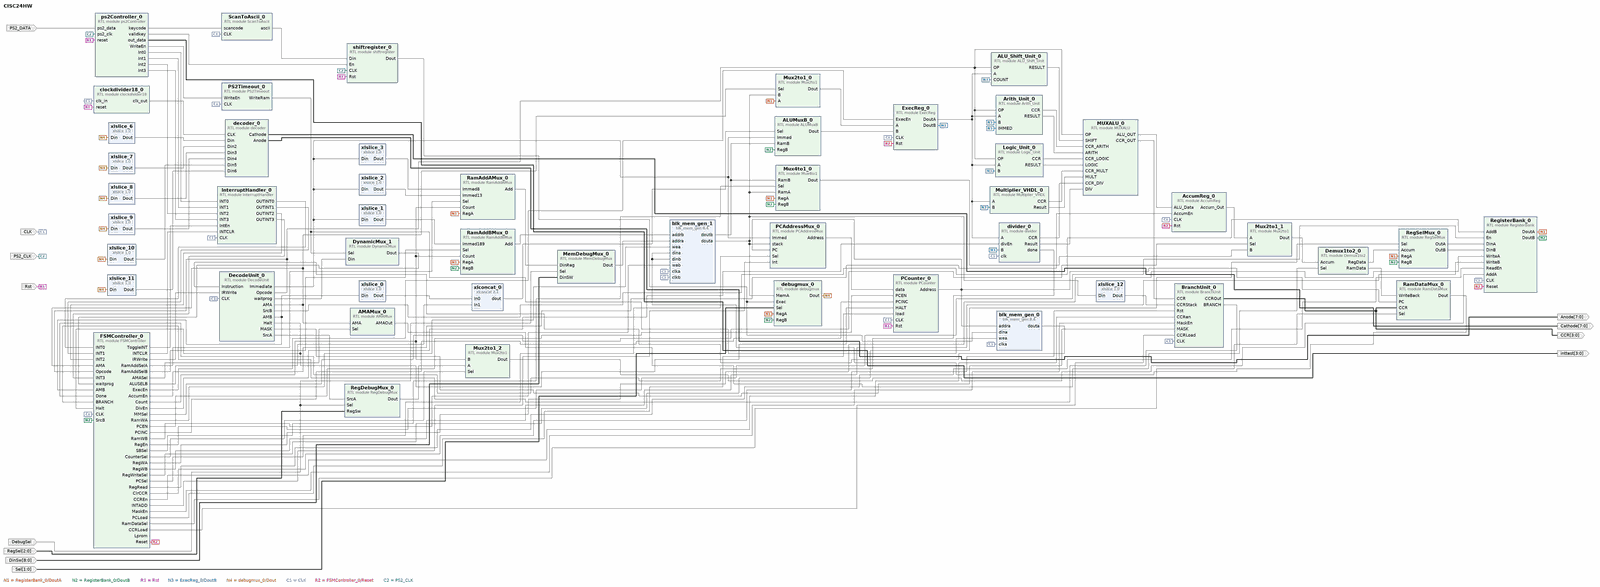
[diagram p0: block diagram of the top level, whole]
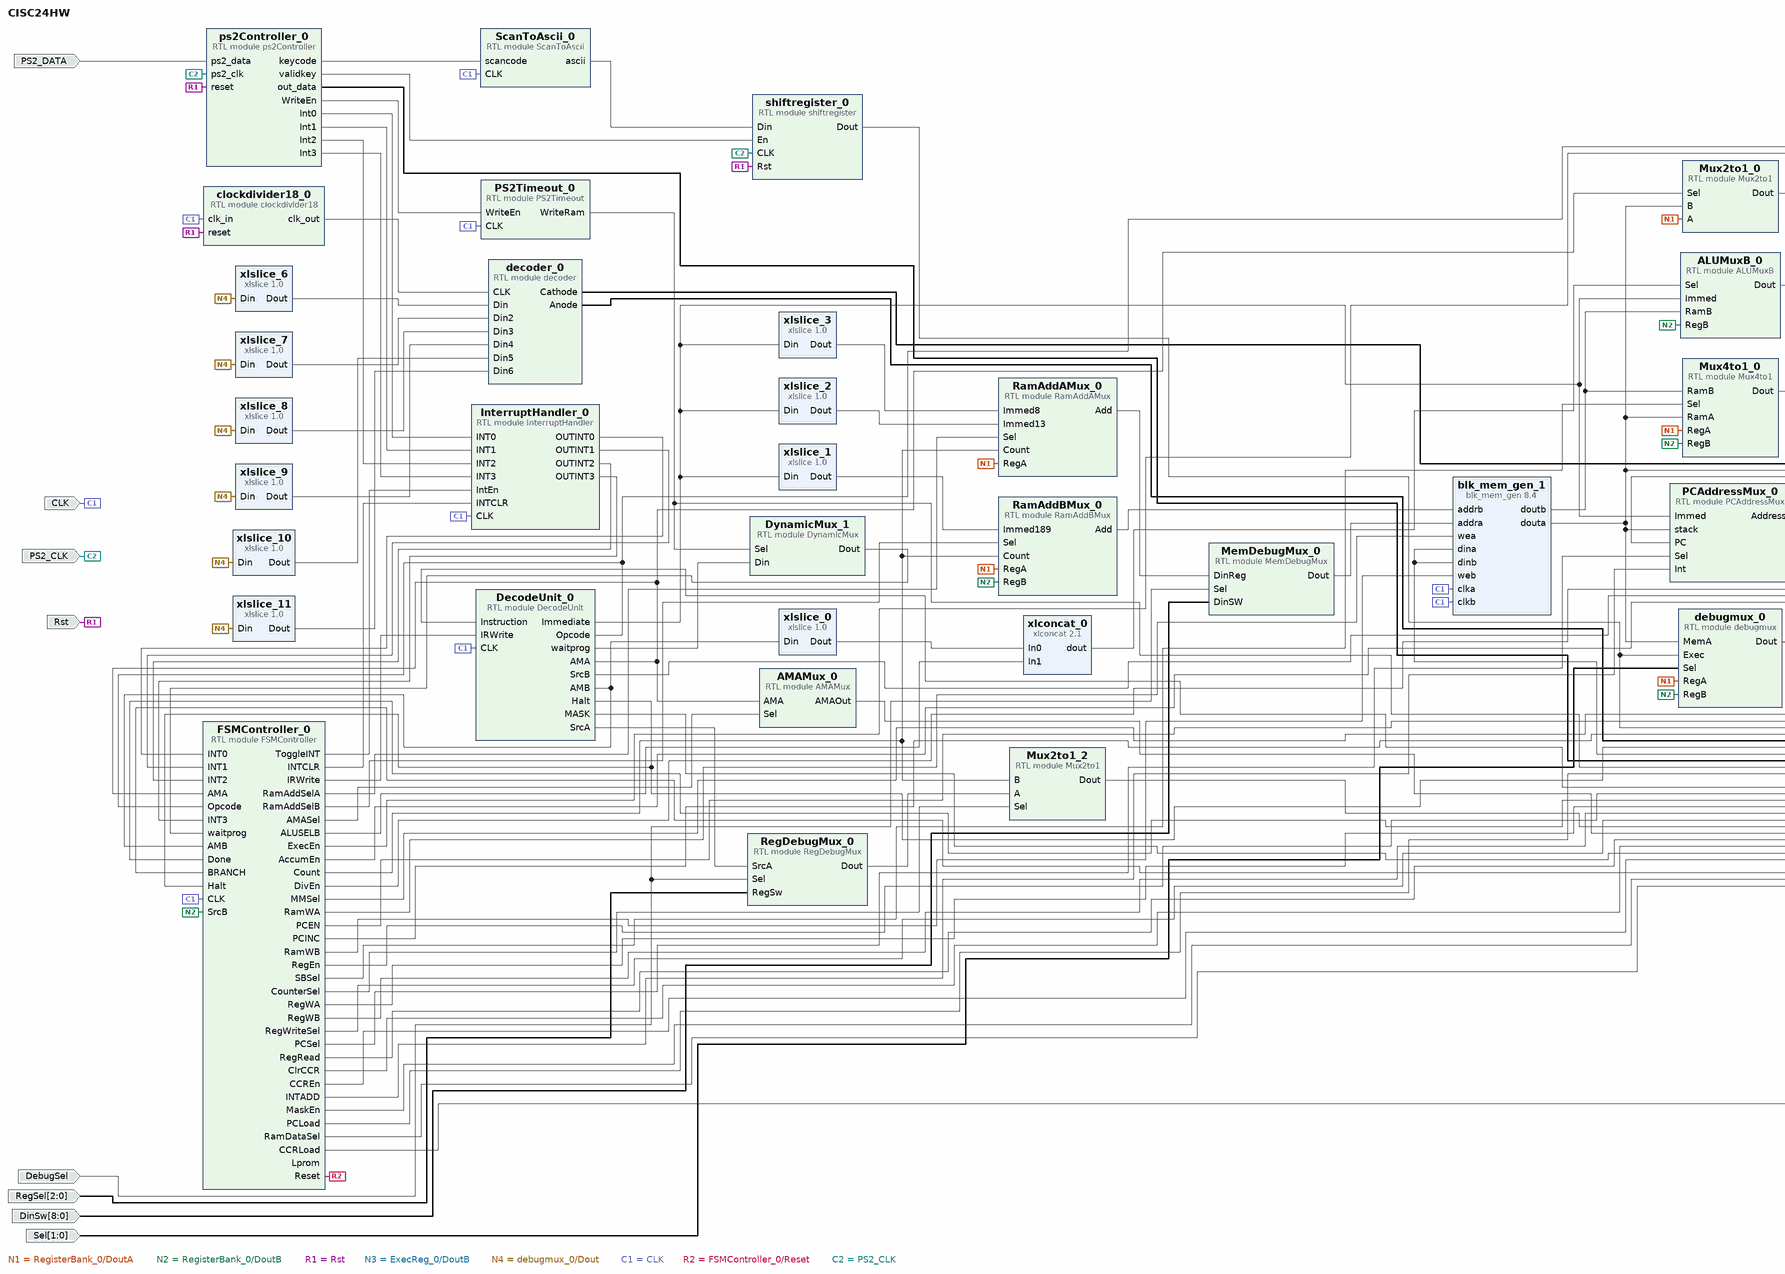
[diagram p1: block diagram of the top level, left part]
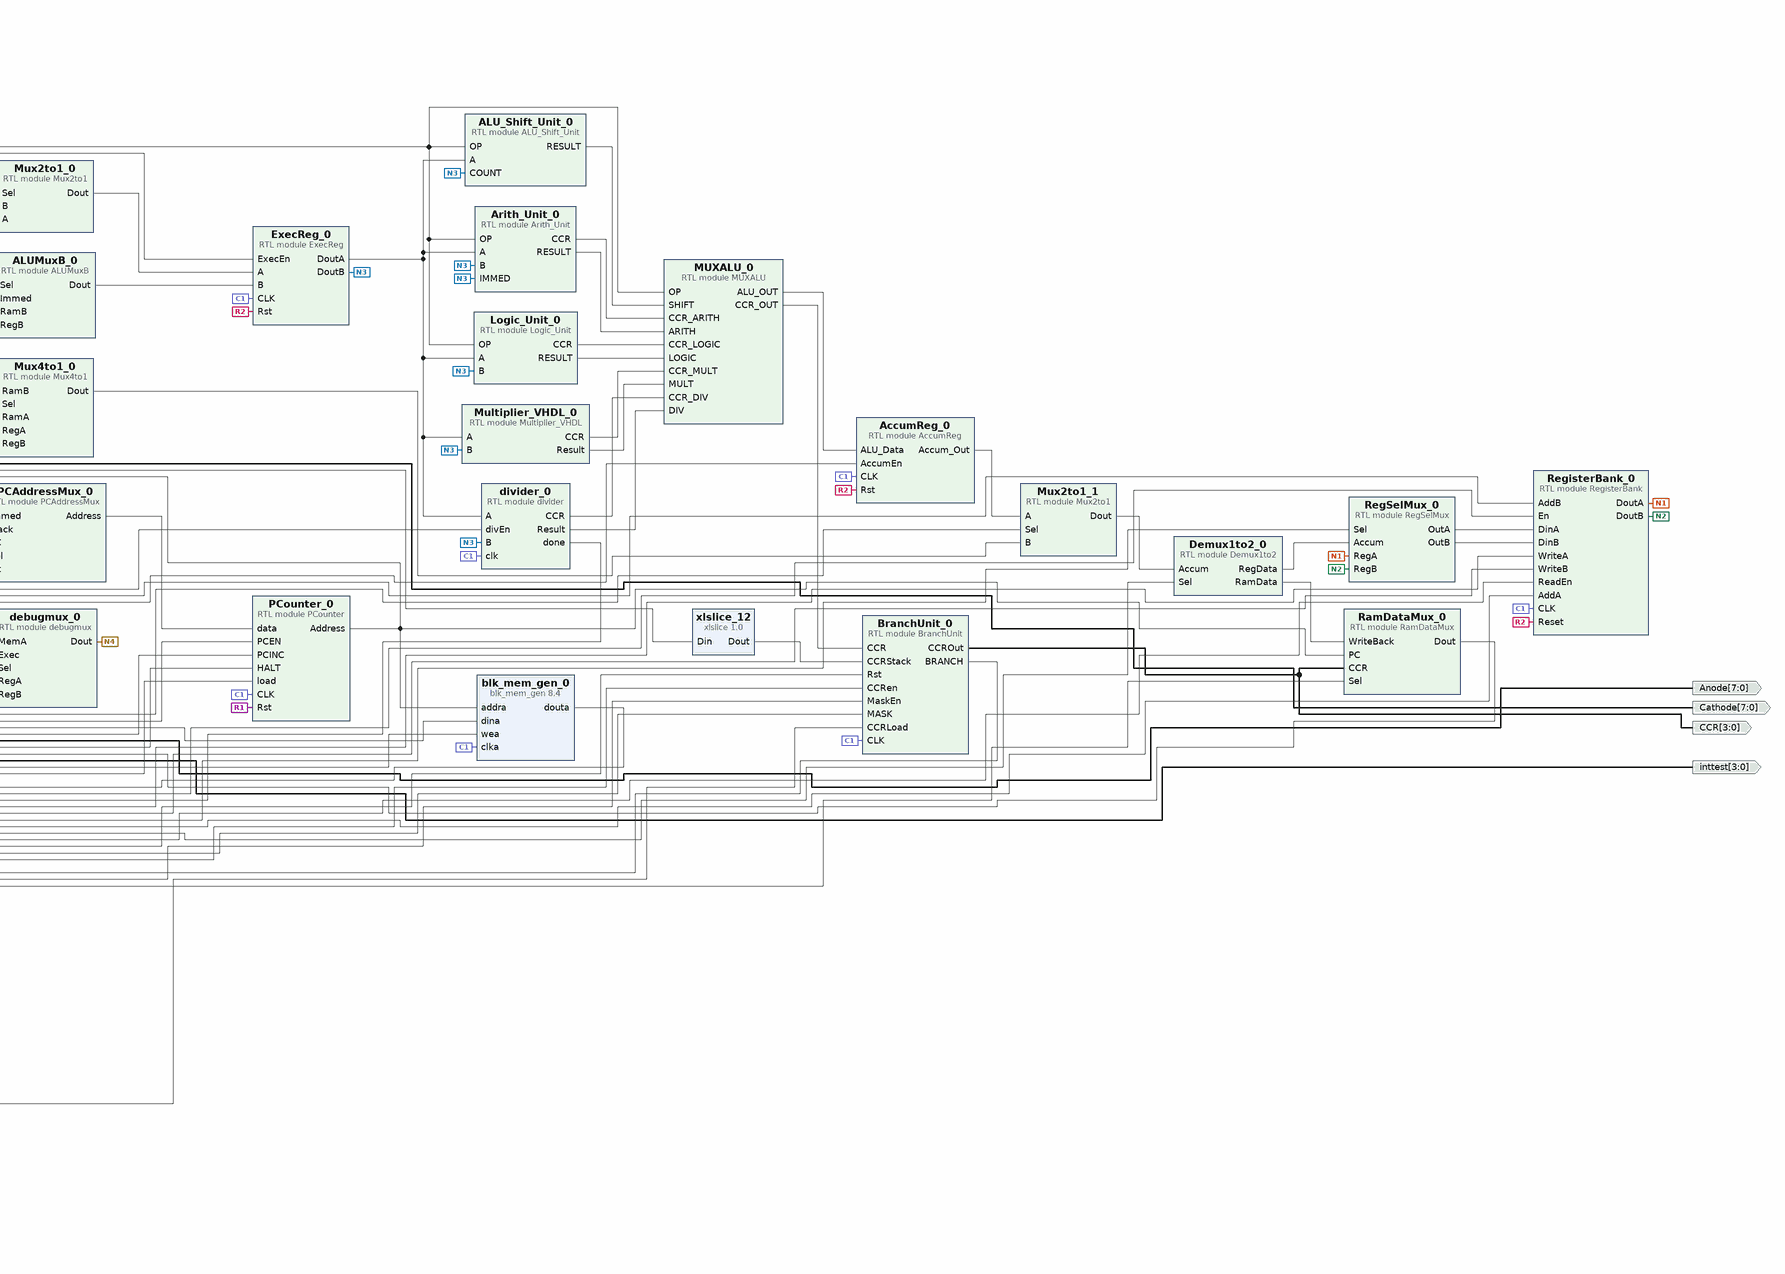
[diagram p2: block diagram of the top level, right part]
# Vivado block design CISC24HW, xc7a100tcsg324-1, Vivado 2017.4
create_bd_design CISC24HW

create_bd_port -dir I -type rst Rst
set_property -dict {CONFIG.POLARITY ACTIVE_HIGH} [get_bd_ports Rst]
create_bd_port -dir O -from 7 -to 0 -type data Cathode
create_bd_port -dir O -from 7 -to 0 -type data Anode
create_bd_port -dir I -type clk CLK
set_property -dict {CONFIG.FREQ_HZ 100000000} [get_bd_ports CLK]
create_bd_port -dir I DebugSel
create_bd_port -dir I -from 8 -to 0 -type data DinSw
create_bd_port -dir O -from 3 -to 0 -type data CCR
create_bd_port -dir I PS2_CLK
create_bd_port -dir I PS2_DATA
create_bd_port -dir O -from 3 -to 0 -type data inttest
create_bd_port -dir I -from 1 -to 0 -type data Sel
create_bd_port -dir I -from 2 -to 0 RegSel

create_bd_cell -type module -reference ALU_Shift_Unit ALU_Shift_Unit_0
create_bd_cell -type module -reference Demux1to2 Demux1to2_0
create_bd_cell -type module -reference MUXALU MUXALU_0
create_bd_cell -type module -reference Multiplier_VHDL Multiplier_VHDL_0
create_bd_cell -type module -reference Mux2to1 Mux2to1_0
create_bd_cell -type module -reference Mux2to1 Mux2to1_1
create_bd_cell -type module -reference Mux4to1 Mux4to1_0
create_bd_cell -type module -reference RegSelMux RegSelMux_0
create_bd_cell -type ip -vlnv xilinx.com:ip:blk_mem_gen:8.4 blk_mem_gen_0
set_property -dict [list \
  CONFIG.Memory_Type Single_Port_RAM \
  CONFIG.Enable_32bit_Address false \
  CONFIG.Use_Byte_Write_Enable false \
  CONFIG.Write_Width_A 24 \
  CONFIG.Write_Depth_A 512 \
  CONFIG.Read_Width_A 24 \
  CONFIG.Enable_A Always_Enabled \
  CONFIG.Register_PortA_Output_of_Memory_Primitives false \
  CONFIG.Load_Init_File true \
  CONFIG.Coe_File romint.coe \
  CONFIG.Fill_Remaining_Memory_Locations true \
  CONFIG.Remaining_Memory_Locations 080000 \
  CONFIG.Use_RSTA_Pin false \
  CONFIG.Port_A_Write_Rate 50 \
  CONFIG.use_bram_block Stand_Alone \
] [get_bd_cells blk_mem_gen_0]
create_bd_cell -type ip -vlnv xilinx.com:ip:blk_mem_gen:8.4 blk_mem_gen_1
set_property -dict [list \
  CONFIG.Memory_Type True_Dual_Port_RAM \
  CONFIG.Enable_32bit_Address false \
  CONFIG.Use_Byte_Write_Enable false \
  CONFIG.Assume_Synchronous_Clk true \
  CONFIG.Write_Width_A 24 \
  CONFIG.Write_Depth_A 522 \
  CONFIG.Read_Width_A 24 \
  CONFIG.Enable_A Always_Enabled \
  CONFIG.Write_Width_B 24 \
  CONFIG.Read_Width_B 24 \
  CONFIG.Enable_B Always_Enabled \
  CONFIG.Register_PortA_Output_of_Memory_Primitives false \
  CONFIG.Register_PortB_Output_of_Memory_Primitives false \
  CONFIG.Fill_Remaining_Memory_Locations true \
  CONFIG.Use_RSTA_Pin false \
  CONFIG.Port_B_Clock 100 \
  CONFIG.Port_B_Write_Rate 50 \
  CONFIG.Port_B_Enable_Rate 100 \
  CONFIG.use_bram_block Stand_Alone \
] [get_bd_cells blk_mem_gen_1]
create_bd_cell -type ip -vlnv xilinx.com:ip:xlconcat:2.1 xlconcat_0
create_bd_cell -type ip -vlnv xilinx.com:ip:xlslice:1.0 xlslice_0
set_property -dict {CONFIG.DIN_TO 0 CONFIG.DIN_FROM 0 CONFIG.DIN_WIDTH 2} [get_bd_cells xlslice_0]
create_bd_cell -type ip -vlnv xilinx.com:ip:xlslice:1.0 xlslice_1
set_property -dict {CONFIG.DIN_TO 9 CONFIG.DIN_FROM 18 CONFIG.DIN_WIDTH 19 CONFIG.DOUT_WIDTH 10} [get_bd_cells xlslice_1]
create_bd_cell -type ip -vlnv xilinx.com:ip:xlslice:1.0 xlslice_2
set_property -dict {CONFIG.DIN_TO 0 CONFIG.DIN_FROM 13 CONFIG.DIN_WIDTH 19 CONFIG.DOUT_WIDTH 14} [get_bd_cells xlslice_2]
create_bd_cell -type ip -vlnv xilinx.com:ip:xlslice:1.0 xlslice_3
set_property -dict {CONFIG.DIN_TO 0 CONFIG.DIN_FROM 8 CONFIG.DIN_WIDTH 19 CONFIG.DOUT_WIDTH 9} [get_bd_cells xlslice_3]
create_bd_cell -type module -reference ALUMuxB ALUMuxB_0
create_bd_cell -type ip -vlnv xilinx.com:ip:xlslice:1.0 xlslice_6
set_property -dict {CONFIG.DIN_TO 0 CONFIG.DIN_FROM 3 CONFIG.DIN_WIDTH 24 CONFIG.DOUT_WIDTH 4} [get_bd_cells xlslice_6]
create_bd_cell -type ip -vlnv xilinx.com:ip:xlslice:1.0 xlslice_7
set_property -dict {CONFIG.DIN_TO 4 CONFIG.DIN_FROM 7 CONFIG.DIN_WIDTH 24 CONFIG.DOUT_WIDTH 4} [get_bd_cells xlslice_7]
create_bd_cell -type ip -vlnv xilinx.com:ip:xlslice:1.0 xlslice_8
set_property -dict {CONFIG.DIN_TO 8 CONFIG.DIN_FROM 11 CONFIG.DIN_WIDTH 24 CONFIG.DOUT_WIDTH 4} [get_bd_cells xlslice_8]
create_bd_cell -type ip -vlnv xilinx.com:ip:xlslice:1.0 xlslice_9
set_property -dict {CONFIG.DIN_TO 12 CONFIG.DIN_FROM 15 CONFIG.DIN_WIDTH 24 CONFIG.DOUT_WIDTH 4} [get_bd_cells xlslice_9]
create_bd_cell -type ip -vlnv xilinx.com:ip:xlslice:1.0 xlslice_10
set_property -dict {CONFIG.DIN_TO 16 CONFIG.DIN_FROM 19 CONFIG.DIN_WIDTH 24 CONFIG.DOUT_WIDTH 4} [get_bd_cells xlslice_10]
create_bd_cell -type ip -vlnv xilinx.com:ip:xlslice:1.0 xlslice_11
set_property -dict {CONFIG.DIN_TO 20 CONFIG.DIN_FROM 23 CONFIG.DIN_WIDTH 24 CONFIG.DOUT_WIDTH 4} [get_bd_cells xlslice_11]
create_bd_cell -type module -reference AccumReg AccumReg_0
create_bd_cell -type module -reference ExecReg ExecReg_0
create_bd_cell -type module -reference divider divider_0
create_bd_cell -type module -reference Arith_Unit Arith_Unit_0
create_bd_cell -type module -reference Logic_Unit Logic_Unit_0
create_bd_cell -type module -reference Mux2to1 Mux2to1_2
create_bd_cell -type module -reference MemDebugMux MemDebugMux_0
create_bd_cell -type module -reference AMAMux AMAMux_0
create_bd_cell -type ip -vlnv xilinx.com:ip:xlslice:1.0 xlslice_12
set_property -dict {CONFIG.DIN_TO 0 CONFIG.DIN_FROM 3 CONFIG.DIN_WIDTH 24 CONFIG.DOUT_WIDTH 4} [get_bd_cells xlslice_12]
create_bd_cell -type module -reference InterruptHandler InterruptHandler_0
create_bd_cell -type module -reference RamAddAMux RamAddAMux_0
create_bd_cell -type module -reference RamAddBMux RamAddBMux_0
create_bd_cell -type module -reference PCAddressMux PCAddressMux_0
create_bd_cell -type module -reference RegisterBank RegisterBank_0
create_bd_cell -type module -reference RamDataMux RamDataMux_0
create_bd_cell -type module -reference shiftregister shiftregister_0
create_bd_cell -type module -reference ScanToAscii ScanToAscii_0
create_bd_cell -type module -reference decoder decoder_0
create_bd_cell -type module -reference DynamicMux DynamicMux_1
create_bd_cell -type module -reference ps2Controller ps2Controller_0
create_bd_cell -type module -reference PCounter PCounter_0
create_bd_cell -type module -reference PS2Timeout PS2Timeout_0
create_bd_cell -type module -reference DecodeUnit DecodeUnit_0
create_bd_cell -type module -reference BranchUnit BranchUnit_0
create_bd_cell -type module -reference FSMController FSMController_0
create_bd_cell -type module -reference clockdivider18 clockdivider18_0
create_bd_cell -type module -reference debugmux debugmux_0
create_bd_cell -type module -reference RegDebugMux RegDebugMux_0

# ---- connections ----

connect_bd_net [get_bd_pins ALU_Shift_Unit_0/RESULT] [get_bd_pins MUXALU_0/SHIFT]
connect_bd_net [get_bd_pins Arith_Unit_0/CCR] [get_bd_pins MUXALU_0/CCR_ARITH]
connect_bd_net [get_bd_pins Arith_Unit_0/RESULT] [get_bd_pins MUXALU_0/ARITH]
connect_bd_net [get_bd_pins DecodeUnit_0/AMA] [get_bd_pins Mux2to1_0/Sel] [get_bd_pins AMAMux_0/AMA] [get_bd_pins FSMController_0/AMA]
connect_bd_net [get_bd_pins DecodeUnit_0/Immediate] \
  [get_bd_pins xlslice_1/Din] [get_bd_pins xlslice_2/Din] [get_bd_pins xlslice_3/Din] [get_bd_pins ALUMuxB_0/Immed] \
  [get_bd_pins PCAddressMux_0/Immed]
connect_bd_net [get_bd_pins DecodeUnit_0/Opcode] \
  [get_bd_pins ALU_Shift_Unit_0/OP] [get_bd_pins MUXALU_0/OP] [get_bd_pins Arith_Unit_0/OP] [get_bd_pins Logic_Unit_0/OP] \
  [get_bd_pins FSMController_0/Opcode]
connect_bd_net [get_bd_pins DecodeUnit_0/SrcB] [get_bd_pins RegisterBank_0/AddB]
connect_bd_net [get_bd_pins FSMController_0/ALUSELB] [get_bd_pins xlconcat_0/In1]
connect_bd_net [get_bd_pins FSMController_0/AccumEn] [get_bd_pins AccumReg_0/AccumEn]
connect_bd_net [get_bd_pins FSMController_0/DivEn] [get_bd_pins divider_0/divEn]
connect_bd_net [get_bd_pins FSMController_0/ExecEn] [get_bd_pins ExecReg_0/ExecEn]
connect_bd_net [get_bd_pins FSMController_0/IRWrite] [get_bd_pins DecodeUnit_0/IRWrite]
# net FSMController_0_Lprom has one end: FSMController_0/Lprom
connect_bd_net [get_bd_pins FSMController_0/MMSel] [get_bd_pins Mux2to1_1/Sel]
connect_bd_net [get_bd_pins FSMController_0/PCEN] [get_bd_pins PCounter_0/PCEN]
connect_bd_net [get_bd_pins FSMController_0/PCINC] [get_bd_pins PCounter_0/PCINC]
connect_bd_net [get_bd_pins FSMController_0/RamAddSelA] [get_bd_pins RamAddAMux_0/Sel]
connect_bd_net [get_bd_pins FSMController_0/RamAddSelB] [get_bd_pins RamAddBMux_0/Sel]
connect_bd_net [get_bd_pins FSMController_0/RamWA] [get_bd_pins blk_mem_gen_1/wea]
connect_bd_net [get_bd_pins FSMController_0/RamWB] [get_bd_pins blk_mem_gen_1/web]
connect_bd_net [get_bd_pins FSMController_0/RegEn] [get_bd_pins RegisterBank_0/En]
connect_bd_net [get_bd_pins FSMController_0/RegWA] [get_bd_pins RegisterBank_0/WriteA]
connect_bd_net [get_bd_pins FSMController_0/RegWB] [get_bd_pins RegisterBank_0/WriteB]
connect_bd_net [get_bd_pins FSMController_0/RegWriteSel] [get_bd_pins RegSelMux_0/Sel]
connect_bd_net [get_bd_pins FSMController_0/SBSel] [get_bd_pins Mux4to1_0/Sel]
connect_bd_net [get_bd_pins Logic_Unit_0/CCR] [get_bd_pins MUXALU_0/CCR_LOGIC]
connect_bd_net [get_bd_pins Logic_Unit_0/RESULT] [get_bd_pins MUXALU_0/LOGIC]
connect_bd_net [get_bd_pins MUXALU_0/ALU_OUT] [get_bd_pins AccumReg_0/ALU_Data]
connect_bd_net [get_bd_pins Multiplier_VHDL_0/CCR] [get_bd_pins MUXALU_0/CCR_MULT]
connect_bd_net [get_bd_pins Multiplier_VHDL_0/Result] [get_bd_pins MUXALU_0/MULT]
connect_bd_net [get_bd_pins Mux2to1_0/Dout] [get_bd_pins ExecReg_0/A]
connect_bd_net [get_bd_pins Mux2to1_1/Dout] [get_bd_pins Demux1to2_0/Accum]
connect_bd_net [get_bd_pins Mux4to1_0/Dout] [get_bd_pins Mux2to1_1/B]
connect_bd_net [get_bd_pins DecodeUnit_0/AMB] [get_bd_pins xlslice_0/Din] [get_bd_pins FSMController_0/AMB]
connect_bd_net [get_bd_pins PCounter_0/Address] [get_bd_pins blk_mem_gen_0/addra] [get_bd_pins PCAddressMux_0/PC] [get_bd_pins RamDataMux_0/PC]
connect_bd_net [get_bd_pins RamAddBMux_0/Add] [get_bd_pins blk_mem_gen_1/addrb]
connect_bd_net [get_bd_pins RegSelMux_0/OutA] [get_bd_pins RegisterBank_0/DinA]
connect_bd_net [get_bd_pins RegSelMux_0/OutB] [get_bd_pins RegisterBank_0/DinB]
connect_bd_net [get_bd_pins RegisterBank_0/DoutA] \
  [get_bd_pins Mux2to1_0/A] [get_bd_pins RegSelMux_0/RegA] [get_bd_pins Mux4to1_0/RegA] [get_bd_pins RamAddAMux_0/RegA] \
  [get_bd_pins RamAddBMux_0/RegA] [get_bd_pins debugmux_0/RegA]
connect_bd_net [get_bd_pins RegisterBank_0/DoutB] \
  [get_bd_pins RegSelMux_0/RegB] [get_bd_pins Mux4to1_0/RegB] [get_bd_pins ALUMuxB_0/RegB] [get_bd_pins RamAddBMux_0/RegB] \
  [get_bd_pins FSMController_0/SrcB] [get_bd_pins debugmux_0/RegB]
connect_bd_net [get_bd_ports Rst] \
  [get_bd_pins shiftregister_0/Rst] [get_bd_pins ps2Controller_0/reset] [get_bd_pins PCounter_0/Rst] \
  [get_bd_pins clockdivider18_0/reset]
connect_bd_net [get_bd_pins blk_mem_gen_0/douta] [get_bd_pins DecodeUnit_0/Instruction]
connect_bd_net [get_bd_pins blk_mem_gen_1/douta] \
  [get_bd_pins Mux2to1_0/B] [get_bd_pins Mux4to1_0/RamA] [get_bd_pins xlslice_12/Din] [get_bd_pins PCAddressMux_0/stack] \
  [get_bd_pins debugmux_0/MemA]
connect_bd_net [get_bd_pins blk_mem_gen_1/doutb] [get_bd_pins Mux4to1_0/RamB] [get_bd_pins ALUMuxB_0/RamB]
connect_bd_net [get_bd_pins divider_0/CCR] [get_bd_pins MUXALU_0/CCR_DIV]
connect_bd_net [get_bd_pins divider_0/Result] [get_bd_pins MUXALU_0/DIV]
connect_bd_net [get_bd_pins xlconcat_0/dout] [get_bd_pins ALUMuxB_0/Sel]
connect_bd_net [get_bd_pins xlslice_0/Dout] [get_bd_pins xlconcat_0/In0]
connect_bd_net [get_bd_pins xlslice_1/Dout] [get_bd_pins RamAddBMux_0/Immed189]
connect_bd_net [get_bd_pins xlslice_2/Dout] [get_bd_pins RamAddAMux_0/Immed13]
connect_bd_net [get_bd_pins xlslice_3/Dout] [get_bd_pins RamAddAMux_0/Immed8]
connect_bd_net [get_bd_pins FSMController_0/RegRead] [get_bd_pins RegisterBank_0/ReadEn]
connect_bd_net [get_bd_pins AccumReg_0/Accum_Out] [get_bd_pins Mux2to1_1/A]
connect_bd_net [get_bd_pins ExecReg_0/DoutB] \
  [get_bd_pins ALU_Shift_Unit_0/COUNT] [get_bd_pins Multiplier_VHDL_0/B] [get_bd_pins divider_0/B] \
  [get_bd_pins Arith_Unit_0/B] [get_bd_pins Arith_Unit_0/IMMED] [get_bd_pins Logic_Unit_0/B]
connect_bd_net [get_bd_pins clockdivider18_0/clk_out] [get_bd_pins decoder_0/CLK]
connect_bd_net [get_bd_pins debugmux_0/Dout] \
  [get_bd_pins xlslice_11/Din] [get_bd_pins xlslice_10/Din] [get_bd_pins xlslice_9/Din] [get_bd_pins xlslice_8/Din] \
  [get_bd_pins xlslice_7/Din] [get_bd_pins xlslice_6/Din]
connect_bd_net [get_bd_pins decoder_0/Cathode] [get_bd_ports Cathode]
connect_bd_net [get_bd_pins decoder_0/Anode] [get_bd_ports Anode]
connect_bd_net [get_bd_pins xlslice_6/Dout] [get_bd_pins decoder_0/Din]
connect_bd_net [get_bd_pins xlslice_7/Dout] [get_bd_pins decoder_0/Din2]
connect_bd_net [get_bd_pins xlslice_8/Dout] [get_bd_pins decoder_0/Din3]
connect_bd_net [get_bd_pins xlslice_9/Dout] [get_bd_pins decoder_0/Din4]
connect_bd_net [get_bd_pins xlslice_10/Dout] [get_bd_pins decoder_0/Din5]
connect_bd_net [get_bd_pins xlslice_11/Dout] [get_bd_pins decoder_0/Din6]
connect_bd_net [get_bd_pins ExecReg_0/DoutA] \
  [get_bd_pins Multiplier_VHDL_0/A] [get_bd_pins ALU_Shift_Unit_0/A] [get_bd_pins divider_0/A] [get_bd_pins Arith_Unit_0/A] \
  [get_bd_pins Logic_Unit_0/A]
connect_bd_net [get_bd_ports CLK] \
  [get_bd_pins blk_mem_gen_0/clka] [get_bd_pins blk_mem_gen_1/clka] [get_bd_pins blk_mem_gen_1/clkb] \
  [get_bd_pins AccumReg_0/CLK] [get_bd_pins ExecReg_0/CLK] [get_bd_pins divider_0/clk] [get_bd_pins InterruptHandler_0/CLK] \
  [get_bd_pins RegisterBank_0/CLK] [get_bd_pins ScanToAscii_0/CLK] [get_bd_pins PCounter_0/CLK] \
  [get_bd_pins PS2Timeout_0/CLK] [get_bd_pins DecodeUnit_0/CLK] [get_bd_pins BranchUnit_0/CLK] \
  [get_bd_pins FSMController_0/CLK] [get_bd_pins clockdivider18_0/clk_in]
connect_bd_net [get_bd_pins Demux1to2_0/RegData] [get_bd_pins RegSelMux_0/Accum]
connect_bd_net [get_bd_pins divider_0/done] [get_bd_pins FSMController_0/Done]
connect_bd_net [get_bd_ports DebugSel] [get_bd_pins MemDebugMux_0/Sel] [get_bd_pins RegDebugMux_0/Sel]
connect_bd_net [get_bd_ports DinSw] [get_bd_pins MemDebugMux_0/DinSW]
connect_bd_net [get_bd_pins RamAddAMux_0/Add] [get_bd_pins MemDebugMux_0/DinReg]
connect_bd_net [get_bd_pins MemDebugMux_0/Dout] [get_bd_pins blk_mem_gen_1/addra]
connect_bd_net [get_bd_pins RegDebugMux_0/Dout] [get_bd_pins Mux2to1_2/A]
connect_bd_net [get_bd_pins DecodeUnit_0/SrcA] [get_bd_pins RegDebugMux_0/SrcA]
connect_bd_net [get_bd_pins Mux2to1_2/Dout] [get_bd_pins RegisterBank_0/AddA]
connect_bd_net [get_bd_pins FSMController_0/Count] [get_bd_pins Mux2to1_2/B] [get_bd_pins RamAddAMux_0/Count] [get_bd_pins RamAddBMux_0/Count]
connect_bd_net [get_bd_pins FSMController_0/CounterSel] [get_bd_pins Mux2to1_2/Sel]
connect_bd_net [get_bd_pins FSMController_0/ClrCCR] [get_bd_pins BranchUnit_0/Rst]
connect_bd_net [get_bd_pins MUXALU_0/CCR_OUT] [get_bd_pins BranchUnit_0/CCR]
connect_bd_net [get_bd_pins FSMController_0/CCREn] [get_bd_pins BranchUnit_0/CCRen]
connect_bd_net [get_bd_pins FSMController_0/MaskEn] [get_bd_pins BranchUnit_0/MaskEn]
connect_bd_net [get_bd_pins DecodeUnit_0/MASK] [get_bd_pins BranchUnit_0/MASK]
connect_bd_net [get_bd_pins BranchUnit_0/BRANCH] [get_bd_pins FSMController_0/BRANCH]
connect_bd_net [get_bd_pins PCAddressMux_0/Address] [get_bd_pins PCounter_0/data]
connect_bd_net [get_bd_pins FSMController_0/PCLoad] [get_bd_pins PCounter_0/load]
connect_bd_net [get_bd_pins FSMController_0/PCSel] [get_bd_pins PCAddressMux_0/Sel]
connect_bd_net [get_bd_pins FSMController_0/INTADD] [get_bd_pins PCAddressMux_0/Int]
connect_bd_net [get_bd_pins InterruptHandler_0/OUTINT0] [get_bd_pins FSMController_0/INT0]
connect_bd_net [get_bd_pins InterruptHandler_0/OUTINT1] [get_bd_pins FSMController_0/INT1]
connect_bd_net [get_bd_pins InterruptHandler_0/OUTINT2] [get_bd_pins FSMController_0/INT2]
connect_bd_net [get_bd_pins InterruptHandler_0/OUTINT3] [get_bd_pins FSMController_0/INT3]
connect_bd_net [get_bd_pins FSMController_0/ToggleINT] [get_bd_pins InterruptHandler_0/IntEn]
connect_bd_net [get_bd_pins FSMController_0/INTCLR] [get_bd_pins InterruptHandler_0/INTCLR]
connect_bd_net [get_bd_pins RamDataMux_0/Dout] [get_bd_pins blk_mem_gen_1/dina] [get_bd_pins blk_mem_gen_1/dinb]
connect_bd_net [get_bd_pins Demux1to2_0/RamData] [get_bd_pins RamDataMux_0/WriteBack]
connect_bd_net [get_bd_pins BranchUnit_0/CCROut] [get_bd_ports CCR] [get_bd_pins RamDataMux_0/CCR]
connect_bd_net [get_bd_pins FSMController_0/RamDataSel] [get_bd_pins RamDataMux_0/Sel]
connect_bd_net [get_bd_pins AMAMux_0/AMAOut] [get_bd_pins Demux1to2_0/Sel]
connect_bd_net [get_bd_pins FSMController_0/AMASel] [get_bd_pins AMAMux_0/Sel]
connect_bd_net [get_bd_pins xlslice_12/Dout] [get_bd_pins BranchUnit_0/CCRStack]
connect_bd_net [get_bd_pins FSMController_0/CCRLoad] [get_bd_pins BranchUnit_0/CCRLoad]
connect_bd_net [get_bd_pins FSMController_0/Reset] [get_bd_pins RegisterBank_0/Reset] [get_bd_pins AccumReg_0/Rst] [get_bd_pins ExecReg_0/Rst]
connect_bd_net [get_bd_pins ps2Controller_0/Int0] [get_bd_pins InterruptHandler_0/INT0]
connect_bd_net [get_bd_pins ps2Controller_0/Int1] [get_bd_pins InterruptHandler_0/INT1]
connect_bd_net [get_bd_pins ps2Controller_0/Int2] [get_bd_pins InterruptHandler_0/INT2]
connect_bd_net [get_bd_ports PS2_CLK] [get_bd_pins shiftregister_0/CLK] [get_bd_pins ps2Controller_0/ps2_clk]
connect_bd_net [get_bd_ports PS2_DATA] [get_bd_pins ps2Controller_0/ps2_data]
connect_bd_net [get_bd_pins ALUMuxB_0/Dout] [get_bd_pins ExecReg_0/B]
connect_bd_net [get_bd_pins ps2Controller_0/Int3] [get_bd_pins InterruptHandler_0/INT3]
connect_bd_net [get_bd_pins ps2Controller_0/out_data] [get_bd_ports inttest]
connect_bd_net [get_bd_pins ps2Controller_0/keycode] [get_bd_pins ScanToAscii_0/scancode]
connect_bd_net [get_bd_pins ScanToAscii_0/ascii] [get_bd_pins shiftregister_0/Din]
connect_bd_net [get_bd_pins shiftregister_0/Dout] [get_bd_pins blk_mem_gen_0/dina] [get_bd_pins debugmux_0/Exec]
connect_bd_net [get_bd_pins ps2Controller_0/validkey] [get_bd_pins shiftregister_0/En]
connect_bd_net -net ps2Controller_0_WriteEn [get_bd_pins PS2Timeout_0/WriteRam] [get_bd_pins blk_mem_gen_0/wea] [get_bd_pins DynamicMux_1/Sel]
connect_bd_net -net DynamicMux_1_Dout [get_bd_pins DecodeUnit_0/Halt] [get_bd_pins PCounter_0/HALT] [get_bd_pins FSMController_0/Halt]
connect_bd_net [get_bd_pins DynamicMux_1/Dout] [get_bd_pins FSMController_0/waitprog]
connect_bd_net [get_bd_pins DecodeUnit_0/waitprog] [get_bd_pins DynamicMux_1/Din]
connect_bd_net [get_bd_pins ps2Controller_0/WriteEn] [get_bd_pins PS2Timeout_0/WriteEn]
connect_bd_net [get_bd_ports Sel] [get_bd_pins debugmux_0/Sel]
connect_bd_net [get_bd_ports RegSel] [get_bd_pins RegDebugMux_0/RegSw]

validate_bd_design
save_bd_design
